# EAGLE schematic Switched_I2C (EAGLE 8.5.1)
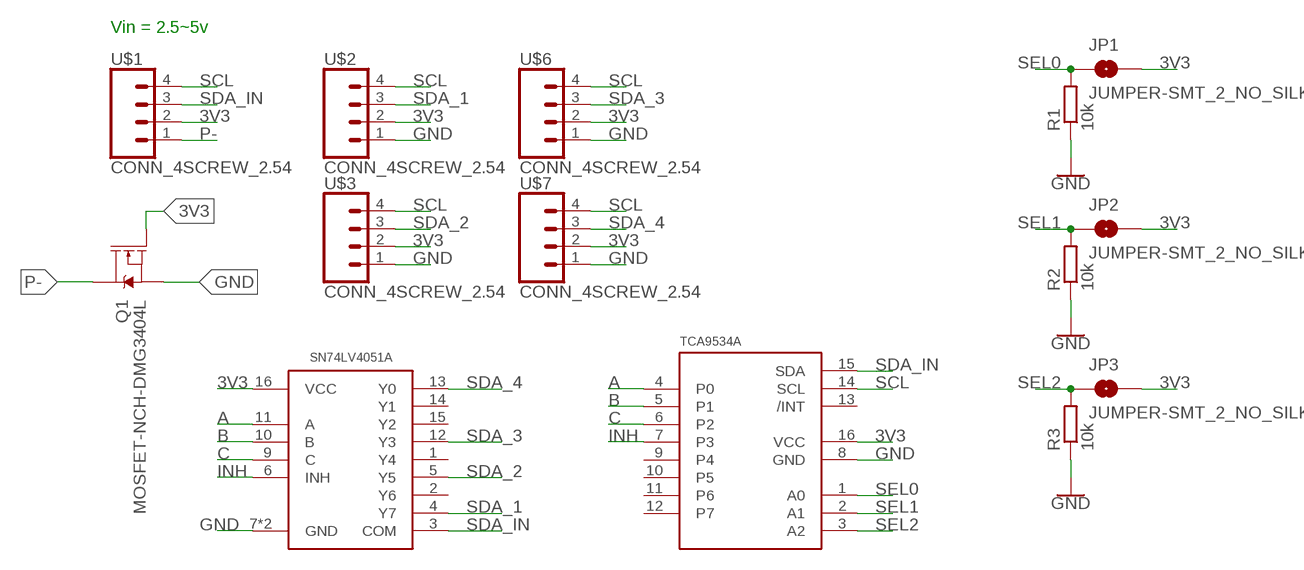
[diagram p0: schematic, sheet 1]

## Parts
JP1  JUMPER-SMT_2_NO_SILK  [SMT-JUMPER_2_NO_SILK]
JP2  JUMPER-SMT_2_NO_SILK  [SMT-JUMPER_2_NO_SILK]
JP3  JUMPER-SMT_2_NO_SILK  [SMT-JUMPER_2_NO_SILK]
Q1  MOSFET-NCH-DMG3404L  [SOT23-3]
R1  10k  R-EU_R0603  [R0603]
R2  10k  R-EU_R0603  [R0603]
R3  10k  R-EU_R0603  [R0603]
U$1  CONN_4SCREW_2.54  [1X04]
U$2  CONN_4SCREW_2.54  [1X04]
U$3  CONN_4SCREW_2.54  [1X04]
U$5  SN74LV4051ATSSOP  [TSSOP16]
U$6  CONN_4SCREW_2.54  [1X04]
U$7  CONN_4SCREW_2.54  [1X04]
U$8  TCA9534A  [TSSOP16]

## Nets
3V3: JP1.2 JP2.2 JP3.2 Q1.1(G) U$1.2 U$2.2 U$3.2 U$5.16(VCC) U$6.2 U$7.2 U$8.16(VCC)
A: U$5.11(A) U$8.4(P0)
B: U$5.10(B) U$8.5(P1)
C: U$5.9(C) U$8.6(P2)
GND: Q1.2(S) R1.1 R2.1 R3.1 U$2.1 U$3.1 U$5.7(GND) U$5.8(GND) U$6.1 U$7.1 U$8.8(GND)
INH: U$5.6(INH) U$8.7(P3)
P-: Q1.3(D) U$1.1
SCL: U$1.4 U$2.4 U$3.4 U$6.4 U$7.4 U$8.14(SCL)
SDA_1: U$2.3 U$5.4(Y7)
SDA_2: U$3.3 U$5.5(Y5)
SDA_3: U$5.12(Y3) U$6.3
SDA_4: U$5.13(Y0) U$7.3
SDA_IN: U$1.3 U$5.3(COM) U$8.15(SDA)
SEL0: JP1.1 R1.2 U$8.1(A0)
SEL1: JP2.1 R2.2 U$8.2(A1)
SEL2: JP3.1 R3.2 U$8.3(A2)
Unconnected: U$5.1(Y4) U$5.2(Y6) U$5.14(Y1) U$5.15(Y2) U$8.9(P4) U$8.10(P5) U$8.11(P6) U$8.12(P7) U$8.13(/INT)

## Notes on the sheet
- Vin = 2.5~5v

## Library data of the parts
JP1-JP3 = SparkFun-Jumpers:JUMPER-SMT_2_NO: Normally open jumper This jumper has two pads in close proximity to each other. Apply solder to close the connection. Round pads are easier to solder for beginners, but are a lot larger. SparkFun Product that uses the round pads: SparkFun EL Sequencer <https://www.sparkfun.com/products/12781>
Q1 = bschulz:MOSFET-NCH: N-channel MOSFETs Voltage controlled devices that allow control of high current outputs. SparkFun Products: SparkFun OpenScale <https://www.sparkfun.com/products/13261> SparkFun Digital Sandbox <https://www.sparkfun.com/products/12651> SparkFun Monster Moto Shield <https://www.sparkfun.com/products/10182> SparkFun MOSFET Power Controller <https://www.sparkfun.com/products/11214>
R1-R3 = bschulz_passives:R-EU_: RESISTOR, European symbol
U$1-U$3 U$6 U$7 = bschulz:CONN_4: Genaric 4 pin connector
U$5 = bschulz:SN74LV4051A: SN74LV4051A - Analog Multiplexer Characteristics: VCC: 2~5.5V Operating Temperature: -40°C to 85°C On state resistace: 75 Ω, Max Channel to Channel Matching: 1.3 Ω, Typical Digikey: 296-41644-1-ND (TSSOP) <https://www.digikey.com/product-detail/en/texas-instruments/SN74LV4051APWRG4/296-41644-1-ND/5224383> 296-13945-1-ND (VQFN) <https://www.digikey.com/product-detail/en/texas-instruments/SN74LV4051ARGYR/296-13945-1-ND/521511>; DIGIKEY: 296-41644-1-ND; MF: TI; MPN: SN74LV4051APWRG4
U$8 = bschulz:TCA9534A: IO Expander, I2C, 3.3V and 5V compatable, 8 input/output, intterupt pin drive